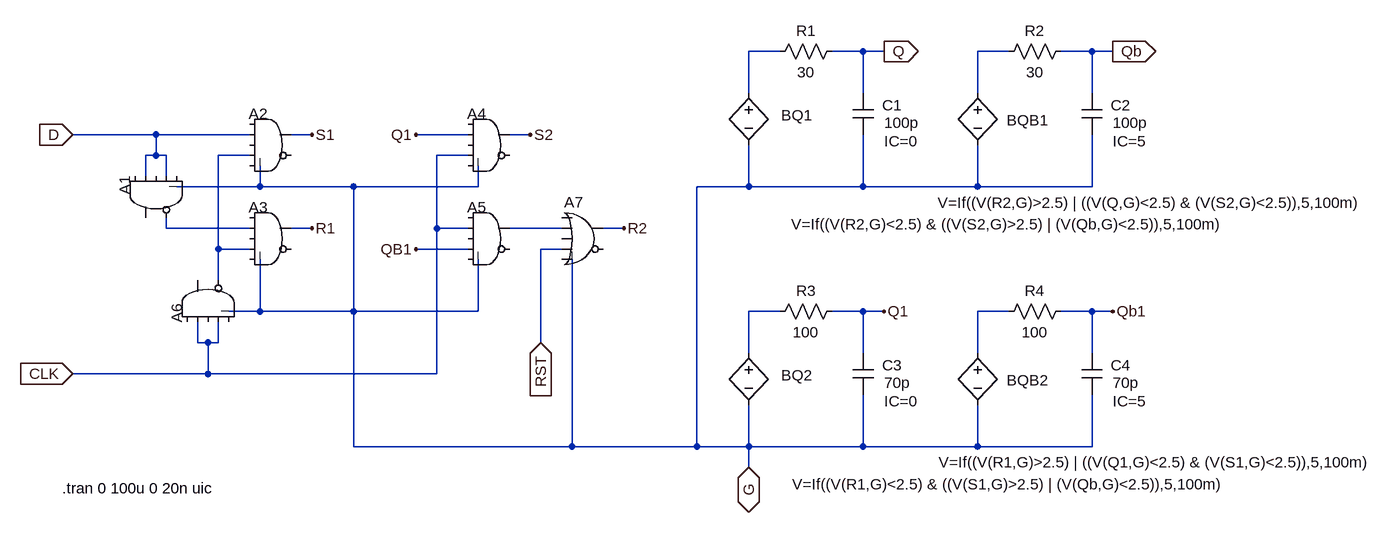
[diagram p0: schematic D_FlipFlop_G_RST.asc]
D_FlipFlop_G_RST.asc, the LTspice schematic file:
Version 4.1
SHEET 1 1472 916
WIRE 480 -288 432 -288
WIRE 608 -288 560 -288
WIRE 640 -288 608 -288
WIRE 832 -288 784 -288
WIRE 960 -288 912 -288
WIRE 992 -288 960 -288
WIRE 432 -224 432 -288
WIRE 608 -224 608 -288
WIRE 784 -224 784 -288
WIRE 960 -224 960 -288
WIRE -480 -160 -608 -160
WIRE -336 -160 -480 -160
WIRE -240 -160 -272 -160
WIRE 0 -160 -80 -160
WIRE 96 -160 64 -160
WIRE -480 -128 -480 -160
WIRE -480 -128 -496 -128
WIRE -464 -128 -480 -128
WIRE -336 -128 -384 -128
WIRE 0 -128 -48 -128
WIRE -496 -96 -496 -128
WIRE -464 -96 -464 -128
WIRE -320 -80 -320 -112
WIRE -320 -80 -448 -80
WIRE -176 -80 -320 -80
WIRE 16 -80 16 -112
WIRE 16 -80 -176 -80
WIRE 432 -80 432 -144
WIRE 432 -80 352 -80
WIRE 608 -80 608 -160
WIRE 608 -80 432 -80
WIRE 784 -80 784 -144
WIRE 784 -80 608 -80
WIRE 960 -80 960 -160
WIRE 960 -80 784 -80
WIRE -464 -16 -464 -32
WIRE -336 -16 -464 -16
WIRE -240 -16 -272 -16
WIRE -48 -16 -48 -128
WIRE 0 -16 -48 -16
WIRE 144 -16 64 -16
WIRE 240 -16 208 -16
WIRE -384 16 -384 -128
WIRE -336 16 -384 16
WIRE 0 16 -80 16
WIRE 144 16 112 16
WIRE -384 64 -384 16
WIRE -320 112 -320 32
WIRE -320 112 -368 112
WIRE -176 112 -176 -80
WIRE -176 112 -320 112
WIRE 16 112 16 32
WIRE 16 112 -176 112
WIRE 480 112 432 112
WIRE 608 112 560 112
WIRE 640 112 608 112
WIRE 832 112 784 112
WIRE 960 112 912 112
WIRE 992 112 960 112
WIRE -416 160 -416 128
WIRE -400 160 -416 160
WIRE -384 160 -384 128
WIRE -384 160 -400 160
WIRE 112 160 112 16
WIRE 432 176 432 112
WIRE 608 176 608 112
WIRE 784 176 784 112
WIRE 960 176 960 112
WIRE -400 208 -400 160
WIRE -400 208 -608 208
WIRE -48 208 -48 -16
WIRE -48 208 -400 208
WIRE -176 320 -176 112
WIRE 160 320 160 32
WIRE 160 320 -176 320
WIRE 352 320 352 -80
WIRE 352 320 160 320
WIRE 432 320 432 256
WIRE 432 320 352 320
WIRE 608 320 608 240
WIRE 608 320 432 320
WIRE 784 320 784 256
WIRE 784 320 608 320
WIRE 960 320 960 240
WIRE 960 320 784 320
WIRE 432 352 432 320
FLAG -608 -160 D
IOPIN -608 -160 In
FLAG -608 208 CLK
IOPIN -608 208 In
FLAG 96 -160 S2
FLAG 240 -16 R2
FLAG 640 -288 Q
IOPIN 640 -288 Out
FLAG 992 -288 Qb
IOPIN 992 -288 Out
FLAG -240 -160 S1
FLAG -240 -16 R1
FLAG -80 -160 Q1
FLAG -80 16 QB1
FLAG 640 112 Q1
FLAG 992 112 Qb1
FLAG 432 352 G
IOPIN 432 352 BiDir
FLAG 112 160 RST
IOPIN 112 160 In
SYMBOL Digital\\and -544 -64 M90
WINDOW 0 -33 16 Left 2
SYMATTR InstName A1
SYMATTR SpiceLine Vhigh=5 Vlow=100m Ref=2.5 TD=10n
SYMBOL bv 432 -240 R0
WINDOW 0 50 50 Left 2
WINDOW 3 65 218 Left 2
SYMATTR InstName BQ1
SYMATTR Value V=If((V(R2,G)<2.5) & ((V(S2,G)>2.5) | (V(Qb,G)<2.5)),5,100m)
SYMBOL res 576 -304 R90
WINDOW 0 0 56 VBottom 2
WINDOW 3 32 56 VTop 2
SYMATTR InstName R1
SYMATTR Value 30
SYMBOL cap 592 -224 R0
WINDOW 0 45 19 Left 2
WINDOW 3 48 46 Left 2
WINDOW 123 48 74 Left 2
SYMATTR InstName C1
SYMATTR Value 100p
SYMATTR Value2 IC=0
SYMBOL bv 784 -240 R0
WINDOW 0 45 58 Left 2
WINDOW 3 -61 185 Left 2
SYMATTR InstName BQB1
SYMATTR Value V=If((V(R2,G)>2.5) | ((V(Q,G)<2.5) & (V(S2,G)<2.5)),5,100m)
SYMBOL res 928 -304 R90
WINDOW 0 0 56 VBottom 2
WINDOW 3 32 56 VTop 2
SYMATTR InstName R2
SYMATTR Value 30
SYMBOL cap 944 -224 R0
WINDOW 0 45 19 Left 2
WINDOW 3 48 46 Left 2
WINDOW 123 48 74 Left 2
SYMATTR InstName C2
SYMATTR Value 100p
SYMATTR Value2 IC=5
SYMBOL bv 432 160 R0
WINDOW 0 50 50 Left 2
WINDOW 3 67 218 Left 2
SYMATTR InstName BQ2
SYMATTR Value V=If((V(R1,G)<2.5) & ((V(S1,G)>2.5) | (V(Qb,G)<2.5)),5,100m)
SYMBOL res 576 96 R90
WINDOW 0 0 56 VBottom 2
WINDOW 3 32 56 VTop 2
SYMATTR InstName R3
SYMATTR Value 100
SYMBOL cap 592 176 R0
WINDOW 0 45 19 Left 2
WINDOW 3 48 46 Left 2
WINDOW 123 48 74 Left 2
SYMATTR InstName C3
SYMATTR Value 70p
SYMATTR Value2 IC=0
SYMBOL bv 784 160 R0
WINDOW 0 45 58 Left 2
WINDOW 3 -60 184 Left 2
SYMATTR InstName BQB2
SYMATTR Value V=If((V(R1,G)>2.5) | ((V(Q1,G)<2.5) & (V(S1,G)<2.5)),5,100m)
SYMBOL res 928 96 R90
WINDOW 0 0 56 VBottom 2
WINDOW 3 32 56 VTop 2
SYMATTR InstName R4
SYMATTR Value 100
SYMBOL cap 944 176 R0
WINDOW 0 45 19 Left 2
WINDOW 3 48 46 Left 2
WINDOW 123 48 74 Left 2
SYMATTR InstName C4
SYMATTR Value 70p
SYMATTR Value2 IC=5
SYMBOL Digital\\and -304 -208 R0
WINDOW 0 -33 16 Left 2
SYMATTR InstName A2
SYMATTR SpiceLine Vhigh=5 Vlow=100m Ref=2.5 TD=10n
SYMBOL Digital\\and -304 -64 R0
WINDOW 0 -33 16 Left 2
SYMATTR InstName A3
SYMATTR SpiceLine Vhigh=5 Vlow=100m Ref=2.5 TD=10n
SYMBOL Digital\\and 32 -208 R0
WINDOW 0 -33 16 Left 2
SYMATTR InstName A4
SYMATTR SpiceLine Vhigh=5 Vlow=100m Ref=2.5 TD=10n
SYMBOL Digital\\and 32 -64 R0
WINDOW 0 -33 16 Left 2
SYMATTR InstName A5
SYMATTR SpiceLine Vhigh=5 Vlow=100m Ref=2.5 TD=10n
SYMBOL Digital\\and -464 96 R270
WINDOW 0 -33 16 Left 2
SYMATTR InstName A6
SYMATTR SpiceLine Vhigh=5 Vlow=100m Ref=2.5 TD=10n
SYMBOL Digital\\or 176 -64 R0
WINDOW 0 -28 8 Left 2
SYMATTR InstName A7
SYMATTR SpiceLine Vhigh=5 Vlow=0 Ref=2.5
TEXT -624 384 Left 2 !.tran 0 100u 0 20n uic

The netlist it stands for:
* D_FlipFlop_G_RST.asc
A1 G D G D G N004 G G AND Vhigh=5 Vlow=100m Ref=2.5 TD=10n
BQ1 N001 G V=If((V(R2,G)<2.5) & ((V(S2,G)>2.5) | (V(Qb,G)<2.5)),5,100m)
R1 Q N001 30
C1 Q G 100p IC=0
BQB1 N002 G V=If((V(R2,G)>2.5) | ((V(Q,G)<2.5) & (V(S2,G)<2.5)),5,100m)
R2 Qb N002 30
C2 Qb G 100p IC=5
BQ2 N006 G V=If((V(R1,G)<2.5) & ((V(S1,G)>2.5) | (V(Qb,G)<2.5)),5,100m)
R3 Q1 N006 100
C3 Q1 G 70p IC=0
BQB2 N007 G V=If((V(R1,G)>2.5) | ((V(Q1,G)<2.5) & (V(S1,G)<2.5)),5,100m)
R4 QB1 N007 100
C4 QB1 G 70p IC=5
A2 G D G N003 G G S1 G AND Vhigh=5 Vlow=100m Ref=2.5 TD=10n
A3 G N004 G N003 G G R1 G AND Vhigh=5 Vlow=100m Ref=2.5 TD=10n
A4 G Q1 G CLK G G S2 G AND Vhigh=5 Vlow=100m Ref=2.5 TD=10n
A5 G CLK G QB1 G G N005 G AND Vhigh=5 Vlow=100m Ref=2.5 TD=10n
A6 G CLK G CLK G N003 G G AND Vhigh=5 Vlow=100m Ref=2.5 TD=10n
A7 G N005 G RST G G R2 G OR Vhigh=5 Vlow=0 Ref=2.5
.tran 0 100u 0 20n uic
.backanno
.end